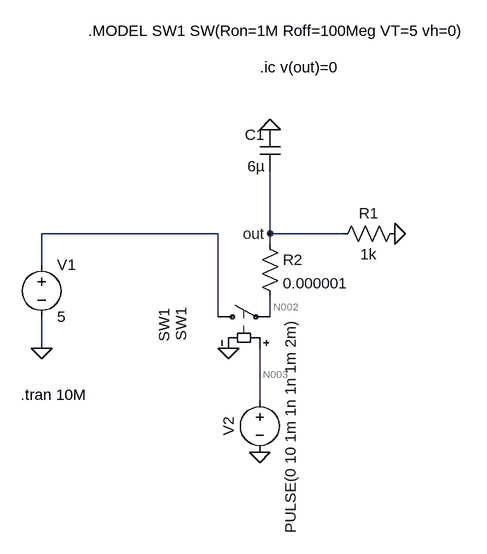
[diagram p0: schematic Draft45.asc]
Draft45.asc, the LTspice schematic file:
Version 4
SHEET 1 880 680
WIRE 192 -16 -80 -16
WIRE 272 -16 272 -112
WIRE 384 -16 272 -16
WIRE 272 0 272 -16
WIRE -80 32 -80 -16
WIRE 192 112 192 -16
WIRE 272 112 272 80
WIRE -80 160 -80 112
WIRE 256 240 256 160
FLAG -80 160 0
FLAG 256 320 0
FLAG 208 160 0
FLAG 464 -16 0
FLAG 272 -16 out
FLAG 272 -176 0
SYMBOL voltage -80 16 R0
WINDOW 123 0 0 Left 0
WINDOW 39 0 0 Left 0
SYMATTR InstName V1
SYMATTR Value 5
SYMBOL sw 176 112 R270
WINDOW 0 -38 -67 Left 2
WINDOW 3 -37 -41 Left 2
SYMATTR InstName SW1
SYMATTR Value SW1
SYMBOL voltage 256 224 R0
WINDOW 0 -32 56 VBottom 2
WINDOW 3 32 56 VTop 2
WINDOW 123 0 0 Left 0
WINDOW 39 0 0 Left 0
SYMATTR InstName V2
SYMATTR Value PULSE(0 10 1m 1n 1n 1m 2m)
SYMBOL res 480 -32 R90
WINDOW 0 0 56 VBottom 2
WINDOW 3 32 56 VTop 2
SYMATTR InstName R1
SYMATTR Value 1k
SYMBOL res 256 -16 R0
SYMATTR InstName R2
SYMATTR Value 0.000001
SYMBOL cap 288 -112 R180
WINDOW 0 24 56 Left 2
WINDOW 3 24 8 Left 2
SYMATTR InstName C1
SYMATTR Value 6µ
TEXT -8 -328 Left 2 !.MODEL SW1 SW(Ron=1M Roff=100Meg VT=5 vh=0)
TEXT -112 232 Left 2 !.tran 10M
TEXT 256 -272 Left 2 !.ic v(out)=0

The netlist it stands for:
* Draft45.asc
V1 N001 0 5
SW1 N001 N002 N003 0 SW1
V2 N003 0 PULSE(0 10 1m 1n 1n 1m 2m)
R1 0 out 1k
R2 out N002 0.000001
C1 out 0 6µ
.MODEL SW1 SW(Ron=1M Roff=100Meg VT=5 vh=0)
.tran 10M
.ic v(out)=0
.backanno
.end

* Results of the author's LTspice run, read from the files saved beside the schematic
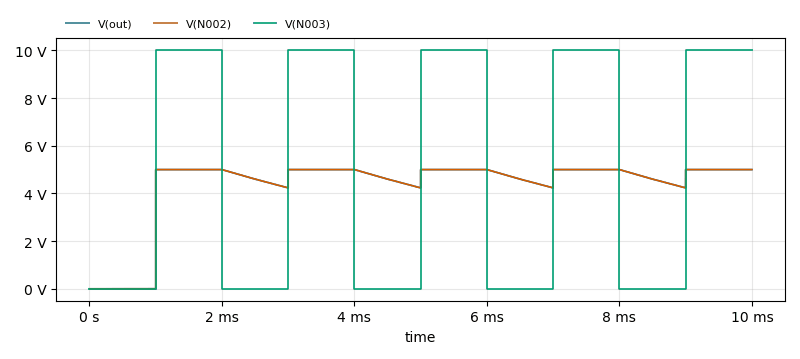
[diagram p1: Transient Analysis of Draft45.asc, plotted from the saved traces]
* Transient Analysis, 1 run:
*   V(out): min 0 V, max 5 V, average 4.343 V, rms 4.585 V, last 5 V
*   V(N002): min 0 V, max 5 V, average 4.343 V, rms 4.585 V, last 5 V
*   V(N003): min 0 V, max 10 V, average 5 V, rms 7.071 V, last 10 V